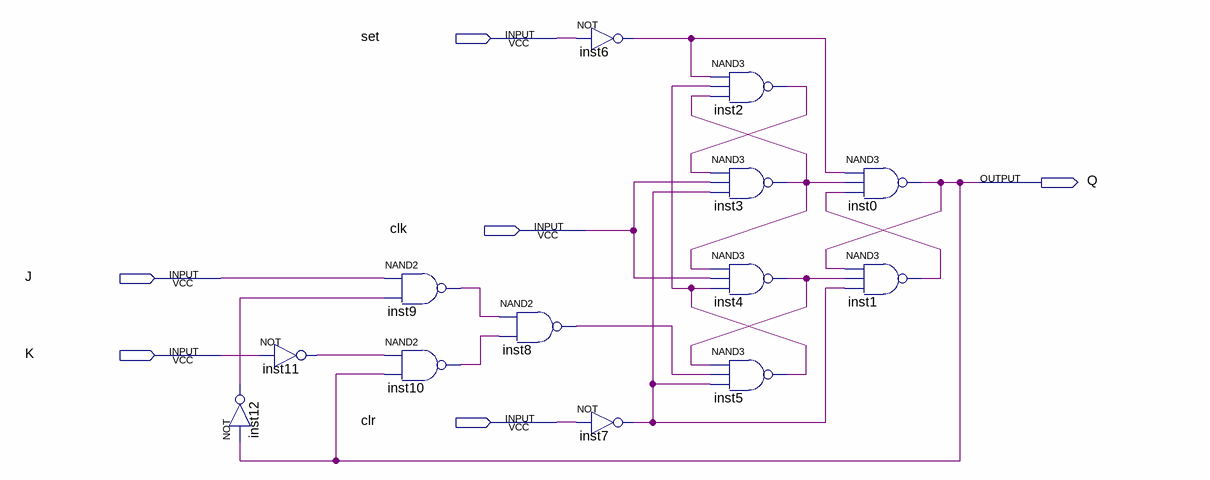
[diagram p0: schematic sheet]
// Quartus schematic FFJK.bdf as structural Verilog: 13 symbols, 6 pins
module FFJK (
  input  set,
  input  clk,
  input  J,
  input  K,
  input  clr,
  output Q
);

  wire inst1_out, inst2_out, inst3_out, inst4_out, inst5_out, inst6_out, inst7_out, inst8_out, inst9_out,
       inst10_out, inst11_out, inst12_out;

  not inst12 (inst12_out, Q);
  not inst11 (inst11_out, K);
  nand inst9 (inst9_out, J, inst12_out);
  nand inst10 (inst10_out, inst11_out, Q);
  nand inst8 (inst8_out, inst9_out, inst10_out);
  not inst6 (inst6_out, set);
  not inst7 (inst7_out, clr);
  nand inst2 (inst2_out, inst6_out, inst5_out, inst3_out);
  nand inst3 (inst3_out, inst2_out, clk, inst7_out);
  nand inst4 (inst4_out, inst3_out, clk, inst5_out);
  nand inst5 (inst5_out, inst4_out, inst8_out, inst7_out);
  nand inst0 (Q, inst6_out, inst3_out, inst1_out);
  nand inst1 (inst1_out, Q, inst4_out, inst7_out);
endmodule
